# Altium project PCB_15122020_01CA.PrjPcb (part 4 of 7)
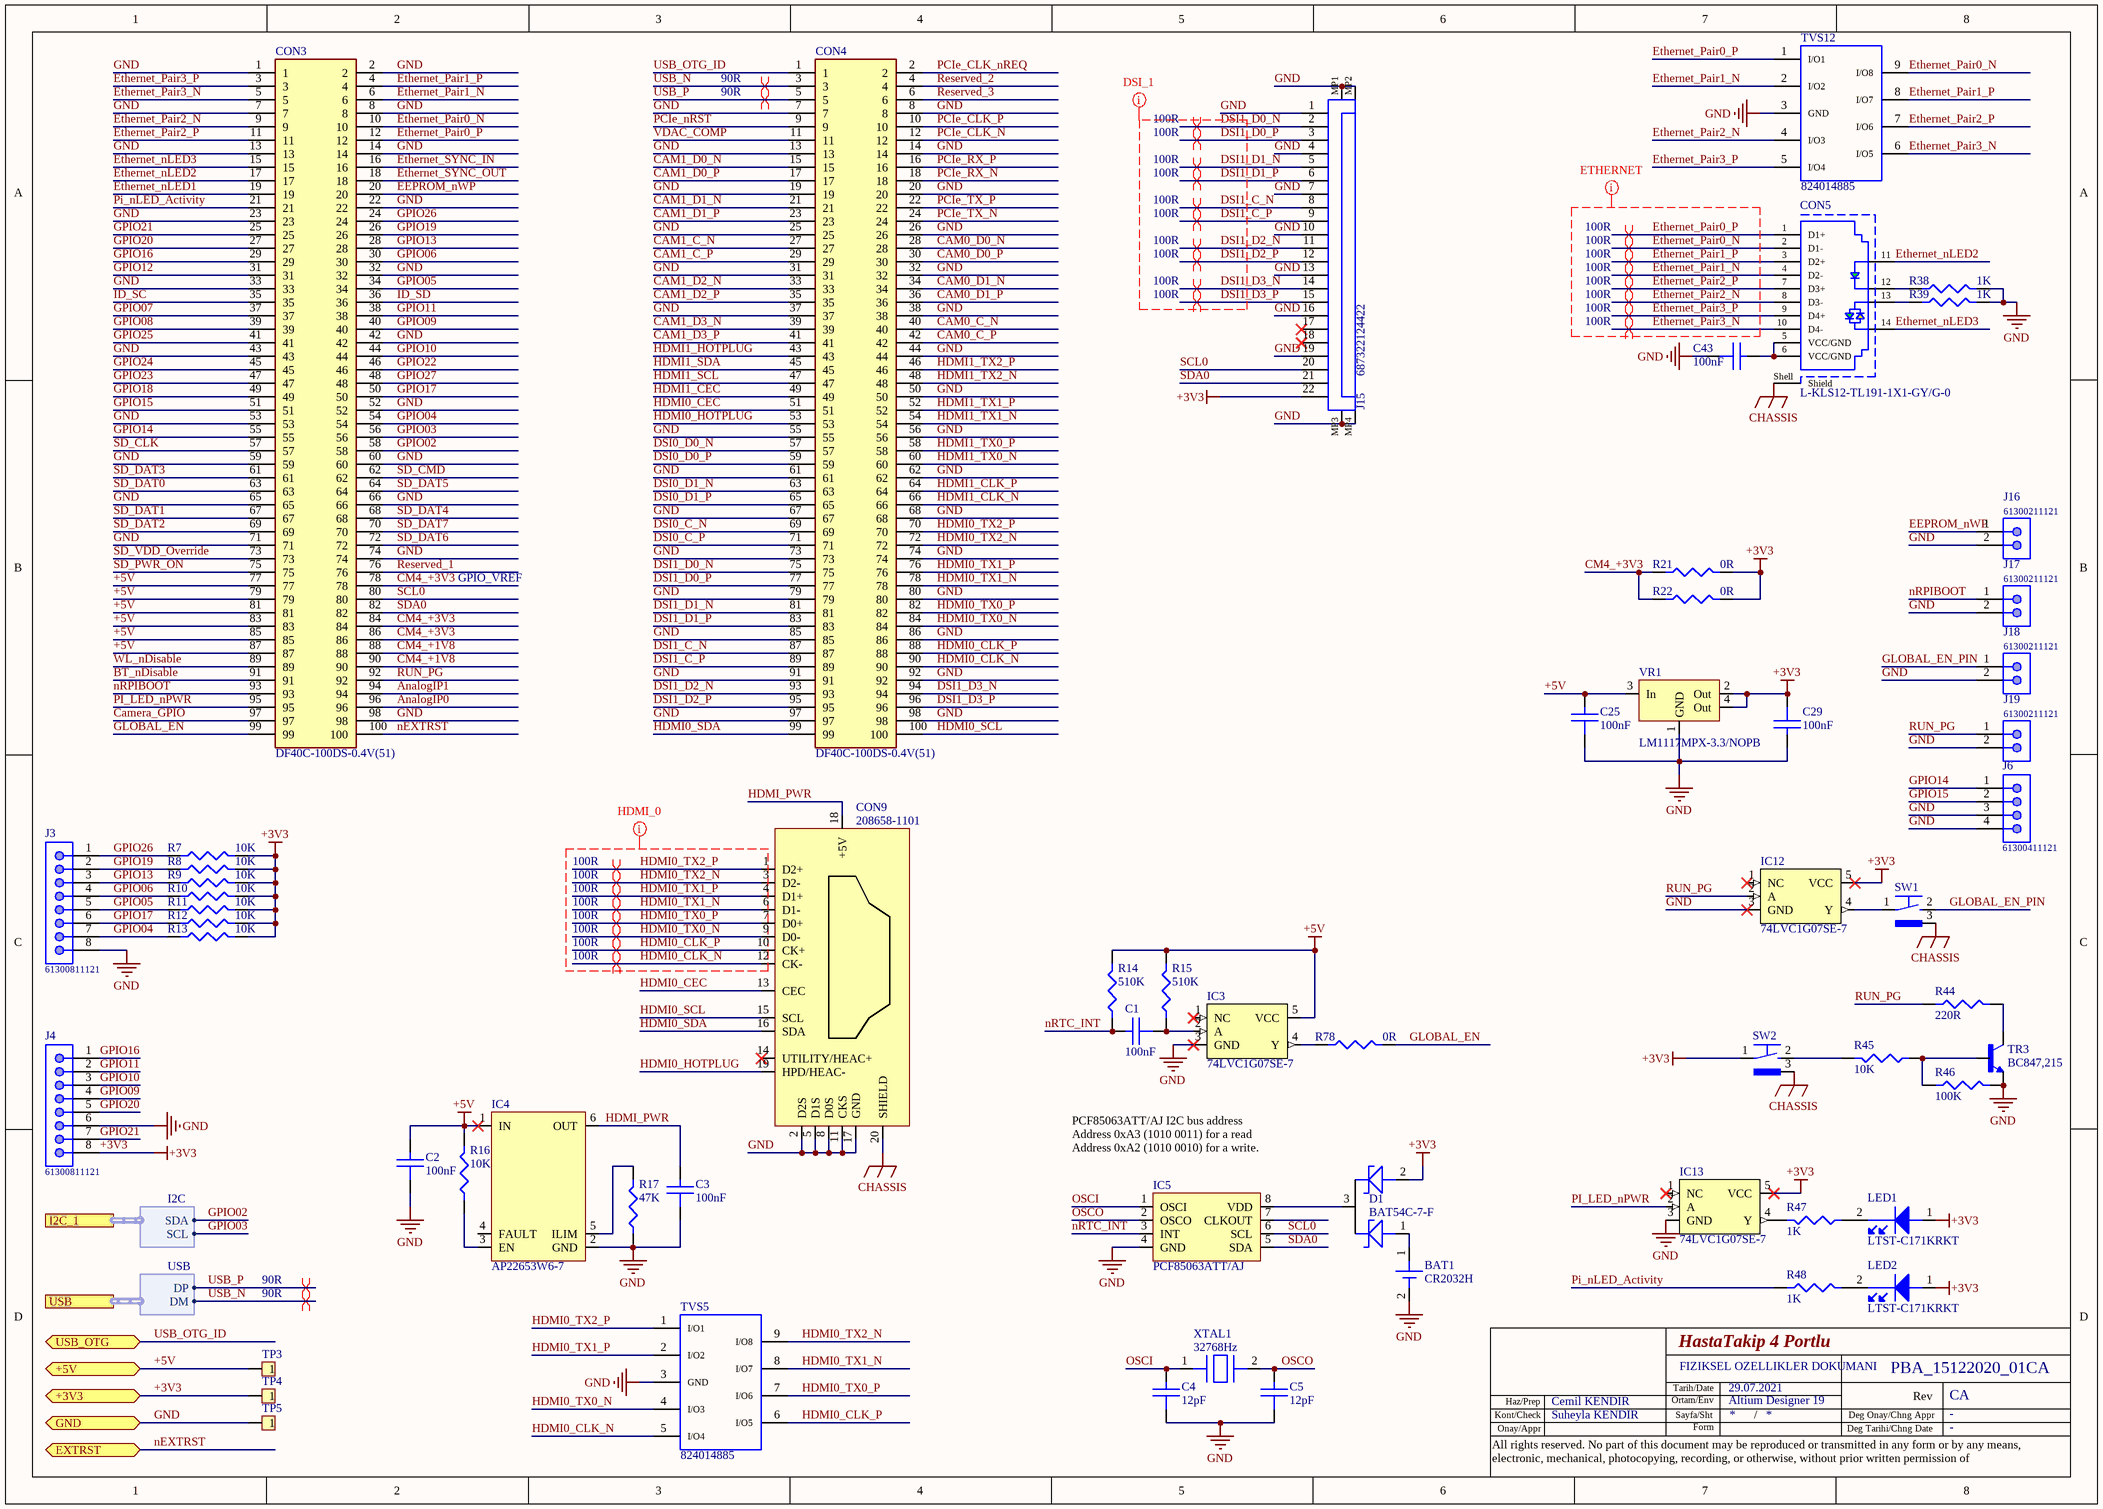
[diagram p8: RaspberyConnector.SchDoc]

## Sheet RaspberyConnector.SchDoc (continued)

### Parts
BAT1  CR2032H  [CR2032H]
C1  100nF  [C0603]
C2  100nF  [C0603]
C3  100nF  [C0603]
C4  12pF  [C0603]
C5  12pF  [C0603]
C25  100nF  [C0603]
C29  100nF  [C0603]
C43  100nF  [C0603]
CON3  DF40C-100DS-0.4V(51)  [HRS_DF40C-100DS-0.4V(51)]
CON4  DF40C-100DS-0.4V(51)  [HRS_DF40C-100DS-0.4V(51)]
CON5  L-KLS12-TL191-1X1-GY/G-0  [L-KLS12-TL191-1X1-GY/G-0]
CON9  208658-1101  [2086581101]
D1  BAT54C-7-F  [SOT23]
IC3  74LVC1G07SE-7  [SOT353]
IC4  AP22653W6-7  [SOT23-6]
IC5  PCF85063ATT/AJ  [SOT505-1]
IC12  74LVC1G07SE-7  [SOT353]
IC13  74LVC1G07SE-7  [SOT353]
J3  61300811121  [61300811121]
J4  61300811121  [61300811121]
J6  61300411121  [61300411121]
J15  687322124422  [687322124422]
J16  61300211121  [61300211121]
J17  61300211121  [61300211121]
J18  61300211121  [61300211121]
J19  61300211121  [61300211121]
LED1  LTST-C171KRKT  [0805_RED]
LED2  LTST-C171KRKT  [0805_RED]
R7  10K  [R0603]
R8  10K  [R0603]
R9  10K  [R0603]
R10  10K  [R0603]
R11  10K  [R0603]
R12  10K  [R0603]
R13  10K  [R0603]
R14  510K  [R0603]
R15  510K  [R0603]
R16  10K  [R0603]
R17  47K  [R0603]
R21  0R  [R0603]
R22  0R  [R0603]
R38  1K  [R0603]
R39  1K  [R0603]
R44  220R  [R0603]
R45  10K  [R0603]
R46  100K  [R0603]
R47  1K  [R0603]
R48  1K  [R0603]
R78  0R  [R0603]
SW1  FSMRACDAH  [FSMRACDAH]  (value not drawn)
SW2  FSMRACDAH  [FSMRACDAH]  (value not drawn)
TP3  TestPoint1  [SMD_2mmPoint]  (value not drawn)
TP4  TestPoint1  [SMD_2mmPoint]  (value not drawn)
TP5  TestPoint1  [SMD_2mmPoint]  (value not drawn)
TR3  BC847,215  [SOT23]
TVS5  824014885  [WE-TVS_DFN3810-9L]
TVS12  824014885  [WE-TVS_DFN3810-9L]
VR1  LM1117MPX-3.3/NOPB  [SOT223-3]
XTAL1  32768Hz  [ForkCrystal]

### Ports
+3V3 (bidir), +5V (bidir), EXTRST (bidir), GND (bidir), I2C_1 (harness I2C), USB (harness USB), USB_OTG (bidir)

### Harnesses
USB: DP, DM
I2C: SCL, SDA

### Nets
+3V3: C29.2 D1.2(K) IC12.5(VCC) IC13.5(VCC) J4.8 J15.22 LED1.1 LED2.1 R7.2 R8.2 R9.2 R10.2 R11.2 R12.2 R13.2 R21.2 R22.2 SW2.1 TP4.1 VR1.2(Out) VR1.4(Out) ; port +3V3
+5V: C2.1 C25.1 CON3.77 CON3.79 CON3.81 CON3.83 CON3.85 CON3.87 IC3.5(VCC) IC4.1(IN) R14.2 R15.2 R16.2 TP3.1 VR1.3(In) ; port +5V
CHASSIS: CON5.Shell(Shield) CON9.20(SHIELD) SW1.3 SW2.3
GND: BAT1.2 C2.2 C3.2 C4.2 C5.2 C25.2 C29.1 C43.2 CON3.1 CON3.2 CON3.7 CON3.8 CON3.13 CON3.14 CON3.22 CON3.23 CON3.32 CON3.33 CON3.42 CON3.43 CON3.52 CON3.53 CON3.59 CON3.60 CON3.65 CON3.66 CON3.71 CON3.74 CON3.98 CON4.7 CON4.8 CON4.13 CON4.14 CON4.19 CON4.20 CON4.25 CON4.26 CON4.31 CON4.32 CON4.37 CON4.38 CON4.44 CON4.50 CON4.55 CON4.56 CON4.61 CON4.62 CON4.67 CON4.68 CON4.73 CON4.74 CON4.79 CON4.80 CON4.85 CON4.86 CON4.91 CON4.92 CON4.97 CON4.98 CON9.2(D2S) CON9.5(D1S) CON9.8(D0S) CON9.11(CKS) CON9.17(GND) IC3.3(GND) IC4.2(GND) IC5.4(GND) IC12.3(GND) IC13.3(GND) J3.8 J4.6 J6.3 J6.4 J15.1 J15.4 J15.7 J15.10 J15.13 J15.16 J15.19 J15.MP1 J15.MP2 J15.MP3 J15.MP4 J16.2 J17.2 J18.2 J19.2 R17.1 R38.2 R39.2 R46.2 TP5.1 TR3.2(E) TVS5.3(GND) TVS12.3(GND) VR1.1(GND) ; port GND
AnalogIP0: CON3.96
AnalogIP1: CON3.94
BT_nDisable: CON3.91
CAM0_C_N: CON4.40
CAM0_C_P: CON4.42
CAM0_D0_N: CON4.28
CAM0_D0_P: CON4.30
CAM0_D1_N: CON4.34
CAM0_D1_P: CON4.36
CAM1_C_N: CON4.27
CAM1_C_P: CON4.29
CAM1_D0_N: CON4.15
CAM1_D0_P: CON4.17
CAM1_D1_N: CON4.21
CAM1_D1_P: CON4.23
CAM1_D2_N: CON4.33
CAM1_D2_P: CON4.35
CAM1_D3_N: CON4.39
CAM1_D3_P: CON4.41
Camera_GPIO: CON3.97
CM4_+1V8: CON3.88 CON3.90
CM4_+3V3: CON3.78 CON3.84 CON3.86 R21.1 R22.1
DSI0_C_N: CON4.69
DSI0_C_P: CON4.71
DSI0_D0_N: CON4.57
DSI0_D0_P: CON4.59
DSI0_D1_N: CON4.63
DSI0_D1_P: CON4.65
DSI1_C_N: CON4.87 J15.8
DSI1_C_P: CON4.89 J15.9
DSI1_D0_N: CON4.75 J15.2
DSI1_D0_P: CON4.77 J15.3
DSI1_D1_N: CON4.81 J15.5
DSI1_D1_P: CON4.83 J15.6
DSI1_D2_N: CON4.93 J15.11
DSI1_D2_P: CON4.95 J15.12
DSI1_D3_N: CON4.94 J15.14
DSI1_D3_P: CON4.96 J15.15
EEPROM_nWP: CON3.20 J16.1
Ethernet_nLED1: CON3.19
Ethernet_nLED2: CON3.17 CON5.11
Ethernet_nLED3: CON3.15 CON5.14
Ethernet_Pair0_N: CON3.10 CON5.2(D1-) TVS12.9(I/O8)
Ethernet_Pair0_P: CON3.12 CON5.1(D1+) TVS12.1(I/O1)
Ethernet_Pair1_N: CON3.6 CON5.4(D2-) TVS12.2(I/O2)
Ethernet_Pair1_P: CON3.4 CON5.3(D2+) TVS12.8(I/O7)
Ethernet_Pair2_N: CON3.9 CON5.8(D3-) TVS12.4(I/O3)
Ethernet_Pair2_P: CON3.11 CON5.7(D3+) TVS12.7(I/O6)
Ethernet_Pair3_N: CON3.5 CON5.10(D4-) TVS12.6(I/O5)
Ethernet_Pair3_P: CON3.3 CON5.9(D4+) TVS12.5(I/O4)
Ethernet_SYNC_IN: CON3.16
Ethernet_SYNC_OUT: CON3.18
GLOBAL_EN: CON3.99 R78.2
GLOBAL_EN_PIN: J18.1 SW1.2
GPIO02: CON3.58 ; port I2C_1.SDA
GPIO03: CON3.56 ; port I2C_1.SCL
GPIO04: CON3.54 J3.7 R13.1
GPIO05: CON3.34 J3.5 R11.1
GPIO06: CON3.30 J3.4 R10.1
GPIO07: CON3.37
GPIO08: CON3.39
GPIO09: CON3.40 J4.4
GPIO10: CON3.44 J4.3
GPIO11: CON3.38 J4.2
GPIO12: CON3.31
GPIO13: CON3.28 J3.3 R9.1
GPIO14: CON3.55 J6.1
GPIO15: CON3.51 J6.2
GPIO16: CON3.29 J4.1
GPIO17: CON3.50 J3.6 R12.1
GPIO18: CON3.49
GPIO19: CON3.26 J3.2 R8.1
GPIO20: CON3.27 J4.5
GPIO21: CON3.25 J4.7
GPIO22: CON3.46
GPIO23: CON3.47
GPIO24: CON3.45
GPIO25: CON3.41
GPIO26: CON3.24 J3.1 R7.1
GPIO27: CON3.48
HDMI0_CEC: CON4.51 CON9.13(CEC)
HDMI0_CLK_N: CON4.90 CON9.12(CK-) TVS5.5(I/O4)
HDMI0_CLK_P: CON4.88 CON9.10(CK+) TVS5.6(I/O5)
HDMI0_HOTPLUG: CON4.53 CON9.19(HPD/HEAC-)
HDMI0_SCL: CON4.100 CON9.15(SCL)
HDMI0_SDA: CON4.99 CON9.16(SDA)
HDMI0_TX0_N: CON4.84 CON9.9(D0-) TVS5.4(I/O3)
HDMI0_TX0_P: CON4.82 CON9.7(D0+) TVS5.7(I/O6)
HDMI0_TX1_N: CON4.78 CON9.6(D1-) TVS5.8(I/O7)
HDMI0_TX1_P: CON4.76 CON9.4(D1+) TVS5.2(I/O2)
HDMI0_TX2_N: CON4.72 CON9.3(D2-) TVS5.9(I/O8)
HDMI0_TX2_P: CON4.70 CON9.1(D2+) TVS5.1(I/O1)
HDMI1_CEC: CON4.49
HDMI1_CLK_N: CON4.66
HDMI1_CLK_P: CON4.64
HDMI1_HOTPLUG: CON4.43
HDMI1_SCL: CON4.47
HDMI1_SDA: CON4.45
HDMI1_TX0_N: CON4.60
HDMI1_TX0_P: CON4.58
HDMI1_TX1_N: CON4.54
HDMI1_TX1_P: CON4.52
HDMI1_TX2_N: CON4.48
HDMI1_TX2_P: CON4.46
HDMI_PWR: C3.1 CON9.18(+5V) IC4.6(OUT)
ID_SC: CON3.35
ID_SD: CON3.36
nEXTRST: CON3.100 ; port EXTRST
nRPIBOOT: CON3.93 J17.1
nRTC_INT: C1.1 IC5.3(INT) R14.1
OSCI: C4.1 IC5.1(OSCI) XTAL1.1
OSCO: C5.1 IC5.2(OSCO) XTAL1.2
PCIe_CLK_N: CON4.12
PCIe_CLK_nREQ: CON4.2
PCIe_CLK_P: CON4.10
PCIe_nRST: CON4.9
PCIe_RX_N: CON4.18
PCIe_RX_P: CON4.16
PCIe_TX_N: CON4.24
PCIe_TX_P: CON4.22
PI_LED_nPWR: CON3.95 IC13.2(A)
Pi_nLED_Activity: CON3.21 R48.1
Reserved_1: CON3.76
Reserved_2: CON4.4
Reserved_3: CON4.6
RUN_PG: CON3.92 IC12.2(A) J19.1 R44.1
SCL0: CON3.80 IC5.6(SCL) J15.20
SD_CLK: CON3.57
SD_CMD: CON3.62
SD_DAT0: CON3.63
SD_DAT1: CON3.67
SD_DAT2: CON3.69
SD_DAT3: CON3.61
SD_DAT4: CON3.68
SD_DAT5: CON3.64
SD_DAT6: CON3.72
SD_DAT7: CON3.70
SD_PWR_ON: CON3.75
SD_VDD_Override: CON3.73
SDA0: CON3.82 IC5.5(SDA) J15.21
USB_N: CON4.3 ; port USB.DM
USB_OTG_ID: CON4.1 ; port USB_OTG
USB_P: CON4.5 ; port USB.DP
VDAC_COMP: CON4.11
WL_nDisable: CON3.89
NetBAT1_1: BAT1.1 D1.1(A)
NetC1_2: C1.2 IC3.2(A) R15.1
NetC43_1: C43.1 CON5.5(VCC/GND) CON5.6(VCC/GND)
NetCON5_12: CON5.12 R38.1
NetCON5_13: CON5.13 R39.1
NetD1_3: D1.3(K) IC5.8(VDD)
NetIC3_4: IC3.4(Y) R78.1
NetIC4_3: IC4.3(EN) R16.1
NetIC4_5: IC4.5(ILIM) R17.2
NetIC12_4: IC12.4(Y) SW1.1
NetIC13_4: IC13.4(Y) R47.2
NetLED1_2: LED1.2 R47.1
NetLED2_2: LED2.2 R48.2
NetR44_2: R44.2 TR3.3(C)
NetR45_1: R45.1 R46.1 TR3.1(B)
NetR45_2: R45.2 SW2.2

Not connected (* = marked no-connect by the designer): CON9 14(UTILITY/HEAC+)*; IC3 1(NC)*; IC4 4(FAULT); IC5 7(CLKOUT); IC12 1(NC)*; IC13 1(NC)*; J15 17* 18*

### Layout directives
differential pair; differential pair class 90R: USB_N, USB_P
differential pair; differential pair class 100R: DSI1_C_N, DSI1_C_P, DSI1_D0_N, DSI1_D0_P, DSI1_D1_N, DSI1_D1_P, DSI1_D2_N, DSI1_D2_P, DSI1_D3_N, DSI1_D3_P, Ethernet_Pair0_N, Ethernet_Pair0_P, Ethernet_Pair1_N, Ethernet_Pair1_P, Ethernet_Pair2_N, Ethernet_Pair2_P, Ethernet_Pair3_N, Ethernet_Pair3_P, HDMI0_CLK_N, HDMI0_CLK_P, HDMI0_TX0_N, HDMI0_TX0_P, HDMI0_TX1_N, HDMI0_TX1_P, HDMI0_TX2_N, HDMI0_TX2_P
net class DSI_1: DSI1_C_N, DSI1_C_P, DSI1_D0_N, DSI1_D0_P, DSI1_D1_N, DSI1_D1_P, DSI1_D2_N, DSI1_D2_P, DSI1_D3_N, DSI1_D3_P
net class ETHERNET: Ethernet_Pair0_N, Ethernet_Pair0_P, Ethernet_Pair1_N, Ethernet_Pair1_P, Ethernet_Pair2_N, Ethernet_Pair2_P, Ethernet_Pair3_N, Ethernet_Pair3_P
net class HDMI_0: HDMI0_CLK_N, HDMI0_CLK_P, HDMI0_TX0_N, HDMI0_TX0_P, HDMI0_TX1_N, HDMI0_TX1_P, HDMI0_TX2_N, HDMI0_TX2_P

### Notes on the sheet
- GPIO_VREF
- (near D1) PCF85063ATT/AJ I2C bus address
  Address 0xA3 (1010 0011) for a read
  Address 0xA2 (1010 0010) for a write.
- Tarih/Date
- Kont/Check
- Onay/Appr
- Haz/Prep
- Ortam/Env
- Sayfa/Sht
- Form
- /
- Deg Tarihi/Chng Date
- Deg Onay/Chng Appr
- Rev
- All rights reserved. No part of this document may be reproduced or transmitted in any form or by any means, electronic, mechanical, photocopying, recording, or otherwise, without prior written permission of